# Altium schematic sheet MultiBoard_Digital_Connector.SchDoc
size A3; SheetNumber: 1; SheetTotal: 3
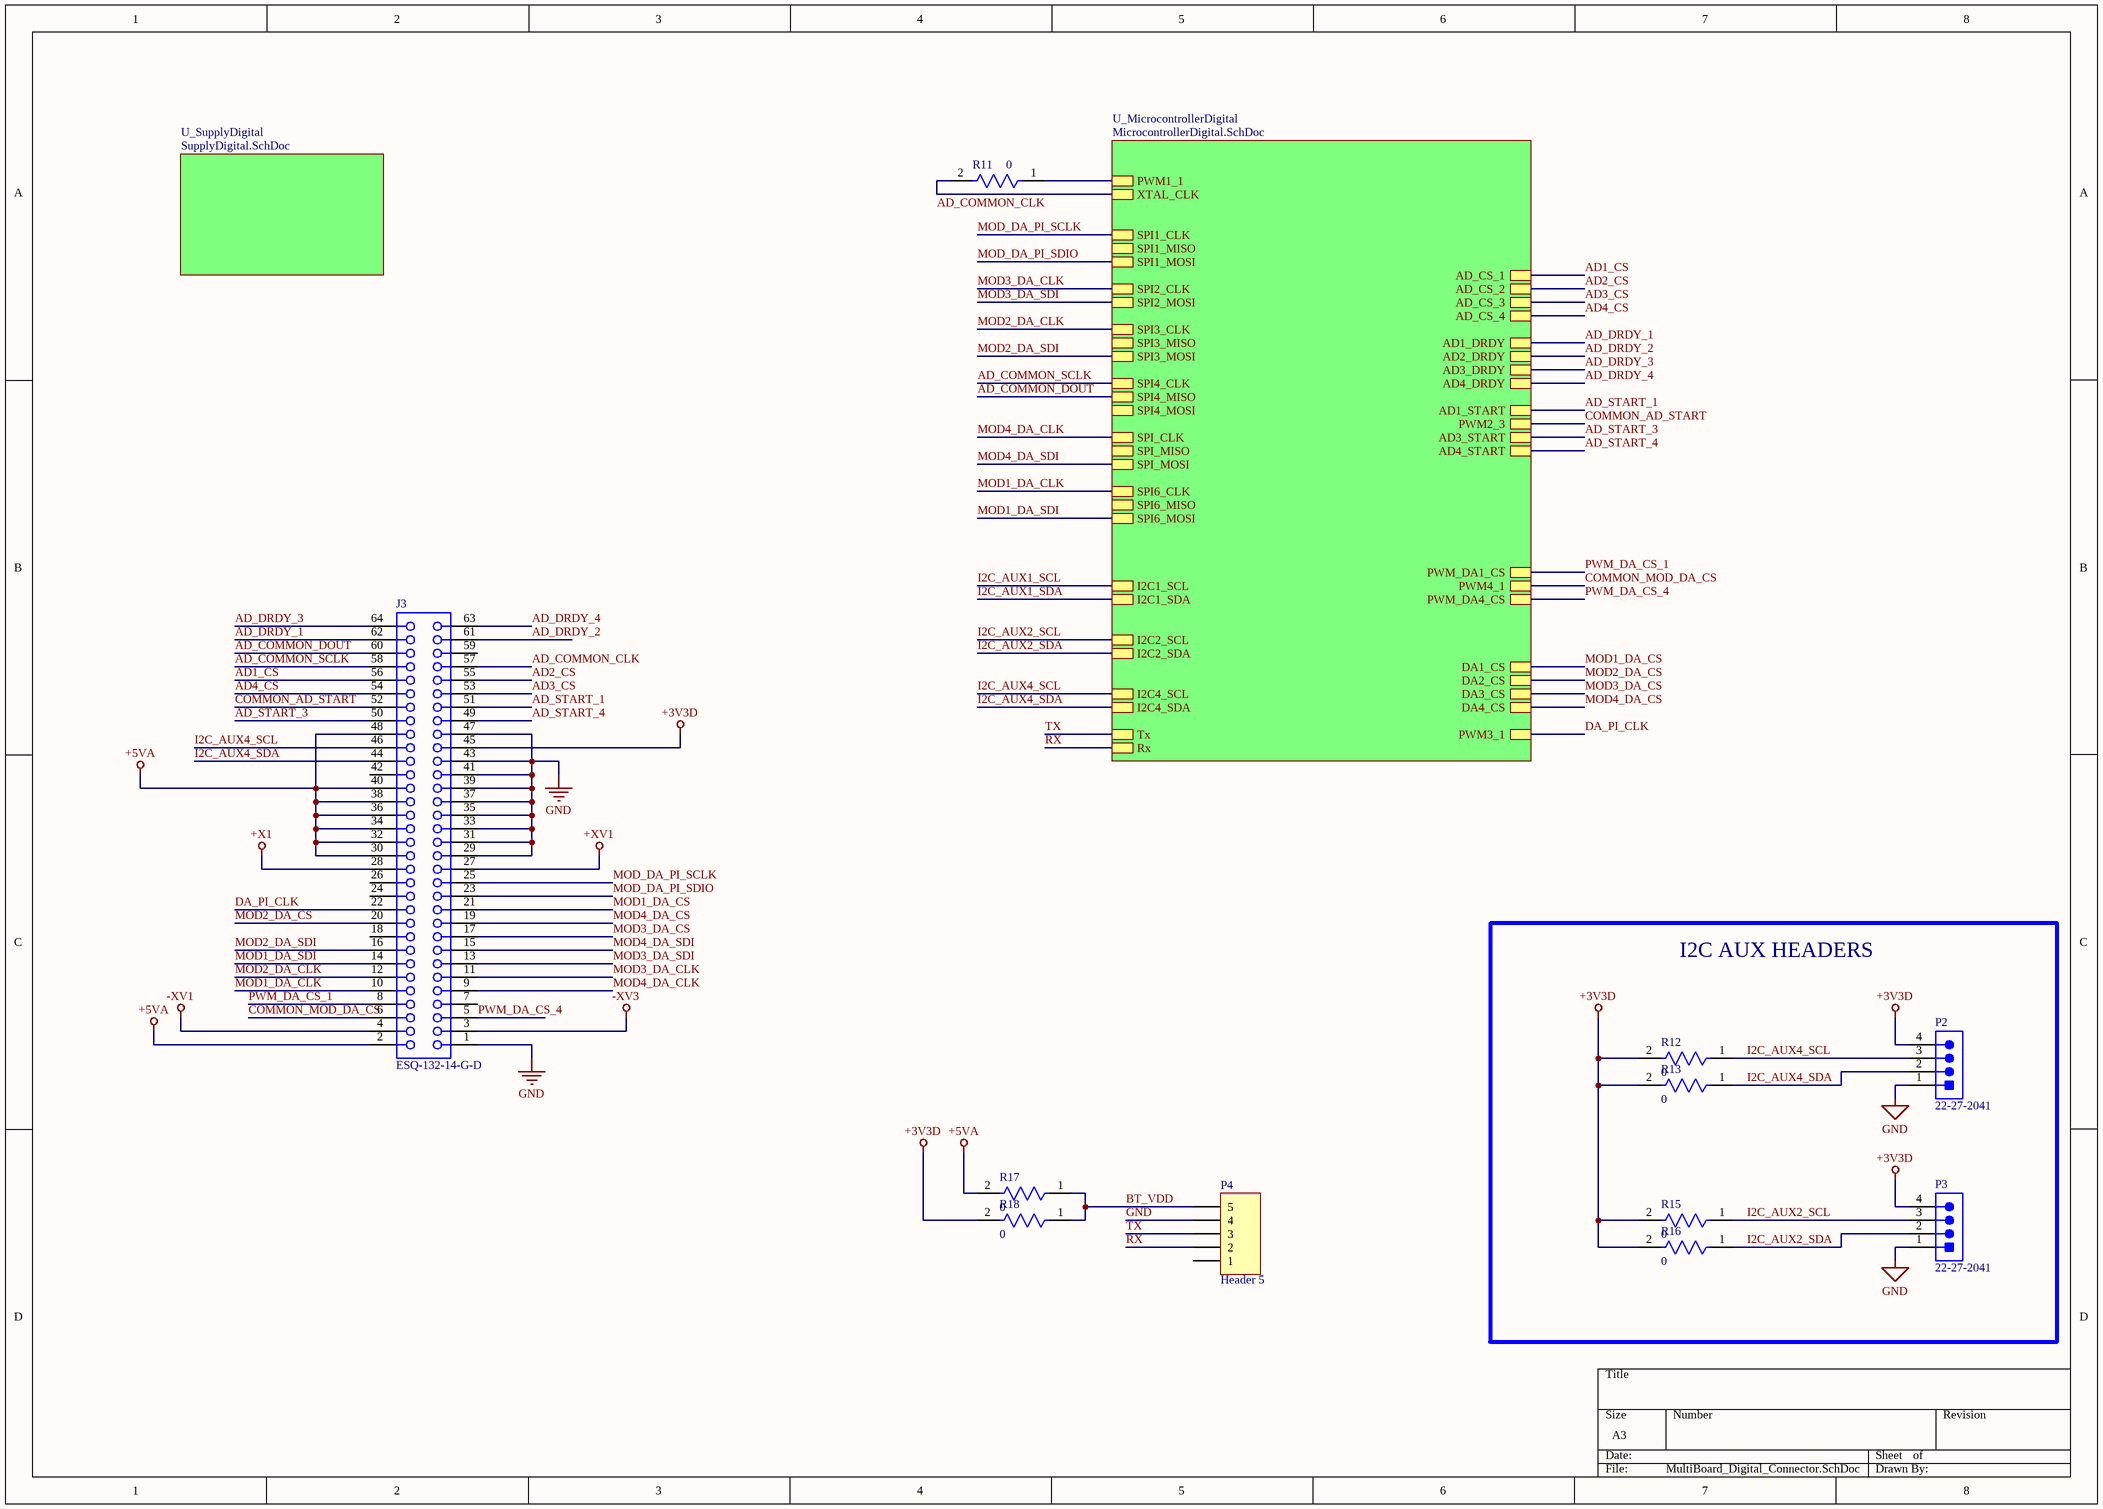
[diagram p0: MultiBoard_Digital_Connector.SchDoc]

## Parts
J3  ESQ-132-14-G-D  [SMTC-ESQ-132-14-X-D]
P2  22-27-2041  [MOLX-22-27-2041_V]
P3  22-27-2041  [MOLX-22-27-2041_V]
P4  Header 5  [HDR1X5]
R11  0  [FP-RR1220-MFG]
R12  0  [FP-RR1220-MFG]
R13  0  [FP-RR1220-MFG]
R15  0  [FP-RR1220-MFG]
R16  0  [FP-RR1220-MFG]
R17  0  [FP-RR1220-MFG]
R18  0  [FP-RR1220-MFG]

## Blocks framed on the sheet
I2C AUX HEADERS: P2 P3 R12 R13 R15 R16

## Sub-sheets
U_MicrocontrollerDigital = MicrocontrollerDigital.SchDoc: SPI3_CLK, SPI3_MISO, SPI3_MOSI, PWM2_3, PWM4_1, PWM3_1, AD3_DRDY, XTAL_CLK, SPI2_MOSI, SPI_CLK, SPI_MISO, SPI6_MISO, SPI6_CLK, SPI6_MOSI, SPI4_CLK, SPI4_MISO, SPI4_MOSI, SPI_MOSI, SPI1_CLK, SPI1_MISO, SPI1_MOSI, DA3_CS, DA2_CS, DA4_CS, PWM1_1, AD_CS_4, AD_CS_3, AD_CS_2, AD_CS_1, AD1_DRDY, AD2_DRDY, AD4_DRDY, SPI2_CLK, I2C2_SCL, I2C2_SDA, I2C4_SCL, I2C4_SDA, DA1_CS, I2C1_SCL, I2C1_SDA, AD1_START, AD4_START, AD3_START, PWM_DA1_CS, PWM_DA4_CS, Tx, Rx
U_SupplyDigital = SupplyDigital.SchDoc: no entries

## Nets
+3V3D: J3.45 P2.4 P3.4 R12.2 R13.2 R15.2 R16.2 R18.2
+5VA: J3.2 J3.30 J3.32 J3.34 J3.36 J3.38 J3.40 J3.48 R17.2
+X1: J3.28
+XV1: J3.27
-XV1: J3.4
-XV3: J3.3
GND: J3.1 J3.29 J3.31 J3.33 J3.35 J3.37 J3.39 J3.41 J3.43 J3.47 P2.1 P3.1 P4.4
AD1_CS: J3.56 ; sheet U_MicrocontrollerDigital/AD_CS_1
AD2_CS: J3.55 ; sheet U_MicrocontrollerDigital/AD_CS_2
AD3_CS: J3.53 ; sheet U_MicrocontrollerDigital/AD_CS_3
AD4_CS: J3.54 ; sheet U_MicrocontrollerDigital/AD_CS_4
AD_COMMON_CLK: J3.57 R11.2 ; sheet U_MicrocontrollerDigital/XTAL_CLK
AD_COMMON_DOUT: J3.60 ; sheet U_MicrocontrollerDigital/SPI4_MISO
AD_COMMON_SCLK: J3.58 ; sheet U_MicrocontrollerDigital/SPI4_CLK
AD_DRDY_1: J3.62 ; sheet U_MicrocontrollerDigital/AD1_DRDY
AD_DRDY_2: J3.61 ; sheet U_MicrocontrollerDigital/AD2_DRDY
AD_DRDY_3: J3.64 ; sheet U_MicrocontrollerDigital/AD3_DRDY
AD_DRDY_4: J3.63 ; sheet U_MicrocontrollerDigital/AD4_DRDY
AD_START_1: J3.51 ; sheet U_MicrocontrollerDigital/AD1_START
AD_START_3: J3.50 ; sheet U_MicrocontrollerDigital/AD3_START
AD_START_4: J3.49 ; sheet U_MicrocontrollerDigital/AD4_START
BT_VDD: P4.5 R17.1 R18.1
COMMON_AD_START: J3.52 ; sheet U_MicrocontrollerDigital/PWM2_3
COMMON_MOD_DA_CS: J3.6 ; sheet U_MicrocontrollerDigital/PWM4_1
DA_PI_CLK: J3.22 ; sheet U_MicrocontrollerDigital/PWM3_1
I2C_AUX1_SCL: sheet U_MicrocontrollerDigital/I2C1_SCL
I2C_AUX1_SDA: sheet U_MicrocontrollerDigital/I2C1_SDA
I2C_AUX2_SCL: P3.3 R15.1 ; sheet U_MicrocontrollerDigital/I2C2_SCL
I2C_AUX2_SDA: P3.2 R16.1 ; sheet U_MicrocontrollerDigital/I2C2_SDA
I2C_AUX4_SCL: J3.46 P2.3 R12.1 ; sheet U_MicrocontrollerDigital/I2C4_SCL
I2C_AUX4_SDA: J3.44 P2.2 R13.1 ; sheet U_MicrocontrollerDigital/I2C4_SDA
MOD1_DA_CLK: J3.10 ; sheet U_MicrocontrollerDigital/SPI6_CLK
MOD1_DA_CS: J3.21 ; sheet U_MicrocontrollerDigital/DA1_CS
MOD1_DA_SDI: J3.14 ; sheet U_MicrocontrollerDigital/SPI6_MOSI
MOD2_DA_CLK: J3.12 ; sheet U_MicrocontrollerDigital/SPI3_CLK
MOD2_DA_CS: J3.20 ; sheet U_MicrocontrollerDigital/DA2_CS
MOD2_DA_SDI: J3.16 ; sheet U_MicrocontrollerDigital/SPI3_MOSI
MOD3_DA_CLK: J3.11 ; sheet U_MicrocontrollerDigital/SPI2_CLK
MOD3_DA_CS: J3.17 ; sheet U_MicrocontrollerDigital/DA3_CS
MOD3_DA_SDI: J3.13 ; sheet U_MicrocontrollerDigital/SPI2_MOSI
MOD4_DA_CLK: J3.9 ; sheet U_MicrocontrollerDigital/SPI_CLK
MOD4_DA_CS: J3.19 ; sheet U_MicrocontrollerDigital/DA4_CS
MOD4_DA_SDI: J3.15 ; sheet U_MicrocontrollerDigital/SPI_MOSI
MOD_DA_PI_SCLK: J3.25 ; sheet U_MicrocontrollerDigital/SPI1_CLK
MOD_DA_PI_SDIO: J3.23 ; sheet U_MicrocontrollerDigital/SPI1_MOSI
PWM_DA_CS_1: J3.8 ; sheet U_MicrocontrollerDigital/PWM_DA1_CS
PWM_DA_CS_4: J3.5 ; sheet U_MicrocontrollerDigital/PWM_DA4_CS
RX: P4.2 ; sheet U_MicrocontrollerDigital/Rx
TX: P4.3 ; sheet U_MicrocontrollerDigital/Tx
NetR11_1: R11.1 ; sheet U_MicrocontrollerDigital/PWM1_1

Not connected (* = marked no-connect by the designer): J3 7 18 24 26 42 59; P4 1

## Library data of the parts
J3 = CMP-1026-00064-1: PC/104(TM) Elevated Socket Strip, Through-hole, Vertical, -55 to 125 degC, 2.54 mm Pitch, 64-Pin, Female, RoHS; Manufacturer: Samtec; Pitch: 2.54 mm; System: Connector; DatasheetVersion: F-214; Mounting Technology: Through-hole; RoHS: True; PackageReference: ESQ-132-14-X-D; PackageVersion: BZ, 9/1998; Orientation: Vertical; ComponentLink3URL: http://www.samtec.com/documents/webfiles/cpdf/ESQ-1XX-XX-X-X-XXX-XX-X-XX-MKT.pdf; ComponentLink1URL: http://www.samtec.com; PartNumber: ESQ-132-14-G-D; ComponentLink2URL: http://www.samtec.com/documents/webfiles/pdf/ESQ_TH.PDF; ComponentLink3Description: Package Specification; ComponentLink1Description: Manufacturer URL; PackageDescription: ESQ Strip ASM; Temperature Range: -55 to 125 degC; ComponentLink2Description: Datasheet
P2 P3 = CMP-2000-05243-1: Male Header, Pitch 2.54 mm, 1 x 4 Position, Height 11.7 mm, Tail Length 3.56 mm, RoHS, Bulk; Manufacturer: Molex; Voltage rating: 250V; Current rating: 4A; Datasheet Version: Rev. F, 06/2009; Operating temperature: 0degCto+75degC; Contact material: Tinplatedbrass; Manufacturer URL: http://www.molex.com/; Housing material: Nylon(UL94V-0); Datasheet URL: http://www.molex.com/pdm_docs/sd/022272041_sd.pdf
P4 = Header 5: Header, 5-Pin; LatestRevisionDate: 17-Jul-2002; LatestRevisionNote: Re-released for DXP Platform.; Publisher: Altium Limited
R11-R13 R15-R18 = CMP-2001-03560-2: 49.9Ω ±0.5% 0.1W 1/10W Chip Resistor 0805 (2012 Metric) Thin Film; Voltage Rating: 100V; Temperature Coefficient: 50ppm/°C; Max Power Dissipation: 100mW; Resistance: 49.9R; Packaging: Tape and Reel; Length: 0.079inch; Termination: SMD/SMT; Case Code (Metric): 2012; Voltage Rating (DC): 100V; Height: 0.02inch; Width: 0.049inch; RoHS Compliant: Yes; Tolerance: 0.5%; Case/Package: 0805; Resistance Tolerance: 0.5%; Lead Free: Lead Free; Size Code: 0805; Min Operating Temperature: -55°C; Max Operating Temperature: 125°C; Case Code (Imperial): 0805; Package Quantity: 1; Resistor Type: Thin Film; Number of Terminations: 2; Power Rating: 100mW; Series: RR